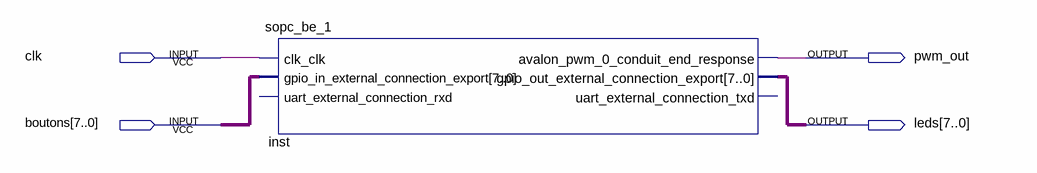
[diagram p0: schematic sheet]
// Quartus schematic BE.bdf as structural Verilog: 1 symbols, 4 pins
module BE (
  input  clk,
  input  [7:0] boutons,
  output pwm_out,
  output [7:0] leds
);

  sopc_be_1 inst (
    .clk_clk(clk), .gpio_in_external_connection_export(boutons), .avalon_pwm_0_conduit_end_response(pwm_out),
    .gpio_out_external_connection_export(leds));  // open: uart_external_connection_rxd, uart_external_connection_txd
endmodule
